# Altium schematic sheet CH32V203CCT-R0.SchDoc
size A4; SheetNumber: 2; SheetTotal: 4
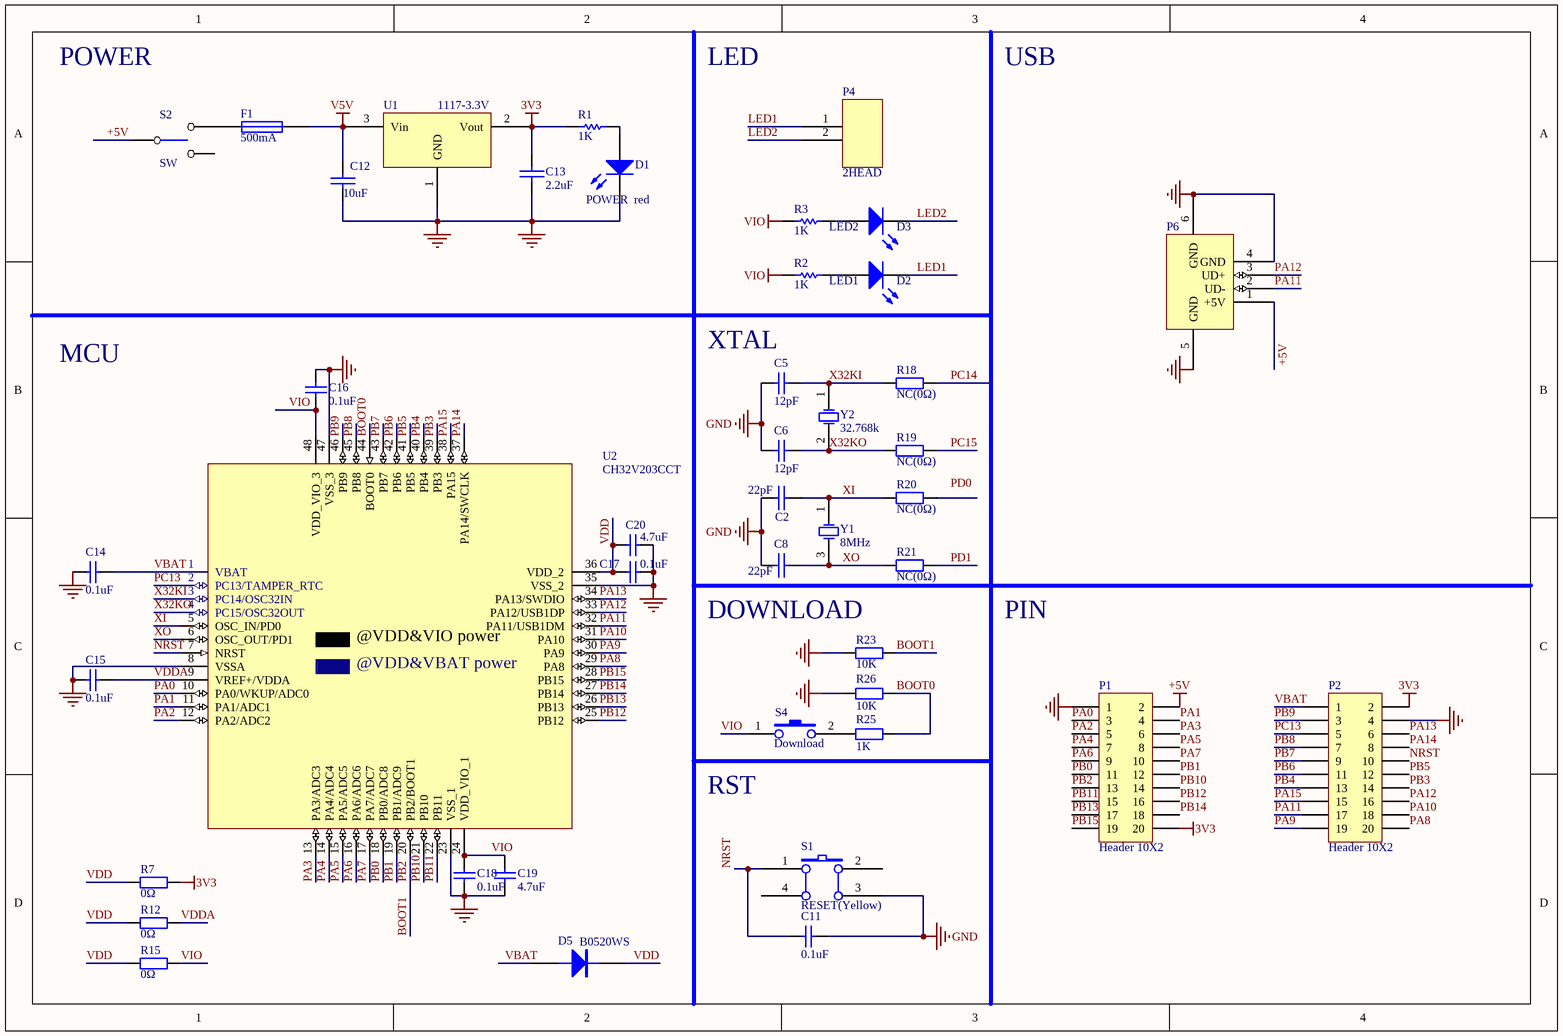
[diagram p0: CH32V203CCT-R0.SchDoc]

## Parts
C2  22pF  [0603_C]
C5  12pF  [0603_C]
C6  12pF  [0603_C]
C8  22pF  [0603_C]
C11  0.1uF  [0603_C]
C12  10uF  [3216_C]
C13  2.2uF  [0603_C]
C14  0.1uF  [0603_C]
C15  0.1uF  [0603_C]
C16  0.1uF  [0603_C]
C17  0.1uF  [0603_C]
C18  0.1uF  [0603_C]
C19  4.7uF  [0603_C]
C20  4.7uF  [0603_C]
D1  POWER  red  [0603+]
D2  LED1  [0603+]
D3  LED2  [0603+]
D5  B0520WS  [SOD-323]
F1  500mA  [0603]
P1  Header 10X2  [IDC20-2.54mm]
P2  Header 10X2  [IDC20-2.54mm]
P4  2HEAD  [SIP2-2.54mm]
P6  USB_A  [USBAF]  (value not drawn)
R1  1K  [0603]
R2  1K  [0603]
R3  1K  [0603]
R7  0Ω  [0603]
R12  0Ω  [0603]
R15  0Ω  [0603]
R18  NC(0Ω)  [0603]
R19  NC(0Ω)  [0603]
R20  NC(0Ω)  [0603]
R21  NC(0Ω)  [0603]
R23  10K  [0603]
R25  1K  [0603]
R26  10K  [0603]
S1  RESET(Yellow)  [KEYX]
S2  SW  [KEY2]
S4  Download  [SMD_6.1x3.65x2.5mm-KEY]
U1  1117-3.3V  [SOT-23]
U2  CH32V203CCT  [LQFP48]
Y1  8MHz  [XT3225]
Y2  32.768k  [FC-135]

## Nets
3V3: C13.1 P1.20 P2.2 R1.2 R7.1 U1.2(Vout)
+5V: P1.2 P6.1(+5V) S2.1
GND: C2.1 C5.2 C6.2 C8.1 C11.1 C12.2 C13.2 C14.2 C15.2 C16.1 C17.1 C18.1 C19.2 C20.1 D1.2(K) P1.1 P2.4 P6.4(GND) P6.5(GND) P6.6(GND) R23.2 R26.2 S1.3(B1) U1.1(GND) U2.8(VSSA) U2.23(VSS_1) U2.35(VSS_2) U2.47(VSS_3)
V5V: C12.1 F1.2 U1.3(Vin)
VIO: C16.2 C18.2 C19.1 R2.1 R3.1 R15.1 S4.1 U2.24(VDD_VIO_1) U2.48(VDD_VIO_3)
BOOT0: R25.1 R26.1 U2.44(BOOT0)
BOOT1: P1.13 R23.1 U2.20(PB2/BOOT1)  [also labelled PB2]
LED1: D2.2(K) P4.1
LED2: D3.2(K) P4.2
NRST: C11.2 P2.10 S1.1(A0) U2.7(NRST)
PA0: P1.3 U2.10(PA0/WKUP/ADC0)
PA1: P1.4 U2.11(PA1/ADC1)
PA2: P1.5 U2.12(PA2/ADC2)
PA3: P1.6 U2.13(PA3/ADC3)
PA4: P1.7 U2.14(PA4/ADC4)
PA5: P1.8 U2.15(PA5/ADC5)
PA6: P1.9 U2.16(PA6/ADC6)
PA7: P1.10 U2.17(PA7/ADC7)
PA8: P2.20 U2.29(PA8)
PA9: P2.19 U2.30(PA9)
PA10: P2.18 U2.31(PA10)
PA11: P2.17 P6.2(UD-) U2.32(PA11/USB1DM)
PA12: P2.16 P6.3(UD+) U2.33(PA12/USB1DP)
PA13: P2.6 U2.34(PA13/SWDIO)
PA14: P2.8 U2.37(PA14/SWCLK)
PA15: P2.15 U2.38(PA15)
PB0: P1.11 U2.18(PB0/ADC8)
PB1: P1.12 U2.19(PB1/ADC9)
PB3: P2.14 U2.39(PB3)
PB4: P2.13 U2.40(PB4)
PB5: P2.12 U2.41(PB5)
PB6: P2.11 U2.42(PB6)
PB7: P2.9 U2.43(PB7)
PB8: P2.7 U2.45(PB8)
PB9: P2.3 U2.46(PB9)
PB10: P1.14 U2.21(PB10)
PB11: P1.15 U2.22(PB11)
PB12: P1.16 U2.25(PB12)
PB13: P1.17 U2.26(PB13)
PB14: P1.18 U2.27(PB14)
PB15: P1.19 U2.28(PB15)
PC13: P2.5 U2.2(PC13/TAMPER_RTC)
PC14: R18.2
PC15: R19.1
PD1: R21.1
VBAT: C14.1 D5.1(A) P2.1 U2.1(VBAT)
VDD: C17.2 C20.2 D5.2(K) R7.2 R12.2 R15.2 U2.36(VDD_2)
VDDA: C15.1 R12.1 U2.9(VREF+/VDDA)
X32KI: C5.1 R18.1 U2.3(PC14/OSC32IN) Y2.1(OSC1)
X32KO: C6.1 R19.2 U2.4(PC15/OSC32OUT) Y2.2(OSC2)
XI: C2.2 R20.2 U2.5(OSC_IN/PD0) Y1.1(OSC1)
XO: C8.2 R21.2 U2.6(OSC_OUT/PD1) Y1.3(OSC2)
NetD1_1: D1.1(A) R1.1
NetD2_1: D2.1(A) R2.2
NetD3_1: D3.1(A) R3.2
NetF1_1: F1.1 S2.3
NetR25_2: R25.2 S4.2

Not connected (* = marked no-connect by the designer): R20 1; S1 2(B0) 4(A1); S2 2

## Notes on the sheet
- POWER
- LED
- USB
- MCU
- (near C5) XTAL
- DOWNLOAD
- PIN
- (near S4) RST
- Labels drawn without touching a wire or pin: PD0
- (in symbol CH32V203CCT) @VDD&VIO power; @VDD&VBAT power

## Library data of the parts
C2 C8 C12 C13 = CAP: Capacitor
C5 C6 C11 C14-C20 = Cap: Capacitor
  C14-C20: Published: 8-Jun-2000; LatestRevisionDate: 17-Jul-2002; LatestRevisionNote: Re-released for DXP Platform.; PackageReference: RAD-0.3; Publisher: Altium Limited
D1-D3 = LED0: Typical INFRARED GaAs LED; Published: 8-Jun-2000; LatestRevisionDate: 08-Jul-2005; LatestRevisionNote: Mech Layer 1 removed.; PackageReference: LED-0; Publisher: Altium Limited
D5 = DIODE
F1 = FUSE1: Fuse
P1 P2 = Header 10X2: Header, 10-Pin, Dual row; LatestRevisionDate: 17-Jul-2002; LatestRevisionNote: Re-released for DXP Platform.; Publisher: Altium Limited
P6 = USB: USB Port
R1-R3 = Res Semi: Semiconductor Resistor; Published: 8-Jun-2000; LatestRevisionDate: 17-Jul-2002; LatestRevisionNote: Re-released for DXP Platform.; PackageReference: AXIAL-0.5; Publisher: Altium Limited; Value: 1K
R7 R12 R15 R18-R21 R23 R25 R26 = Res2: Resistor
  R23 R26: Published: 8-Jun-2000; LatestRevisionDate: 17-Jul-2002; LatestRevisionNote: Re-released for DXP Platform.; PackageReference: AXIAL-0.4; Publisher: Altium Limited; Value: 10K
  R25: Published: 8-Jun-2000; LatestRevisionDate: 17-Jul-2002; LatestRevisionNote: Re-released for DXP Platform.; PackageReference: AXIAL-0.4; Publisher: Altium Limited
S1 = SW PUSHBUTTON: SE PUSHBUTTON
S4 = KEY1
U1 = 6219P33M
U2 = CH32V203CCT: RISC-V MCU, 192MHz, USB FS, PIOC, ADC, TKEY, 2*OPA, 2*CMP
Y1 Y2 = XTAL: Crystal Oscillator; Published: 8-Jun-2000; LatestRevisionDate: 17-Jul-2002; LatestRevisionNote: Re-released for DXP Platform.; PackageReference: R38; Publisher: Altium Limited
  Y1: PackageDescription: Crystal, Thru-Hole; 2 Leads; Body 3.1 x 8.2 mm (Dia.xH)